# EasyEDA Pro project ProProject_J-Link_WiFi_072_V831_Open_2023-09-08.epro, board J-Link_WiFi_072_V831
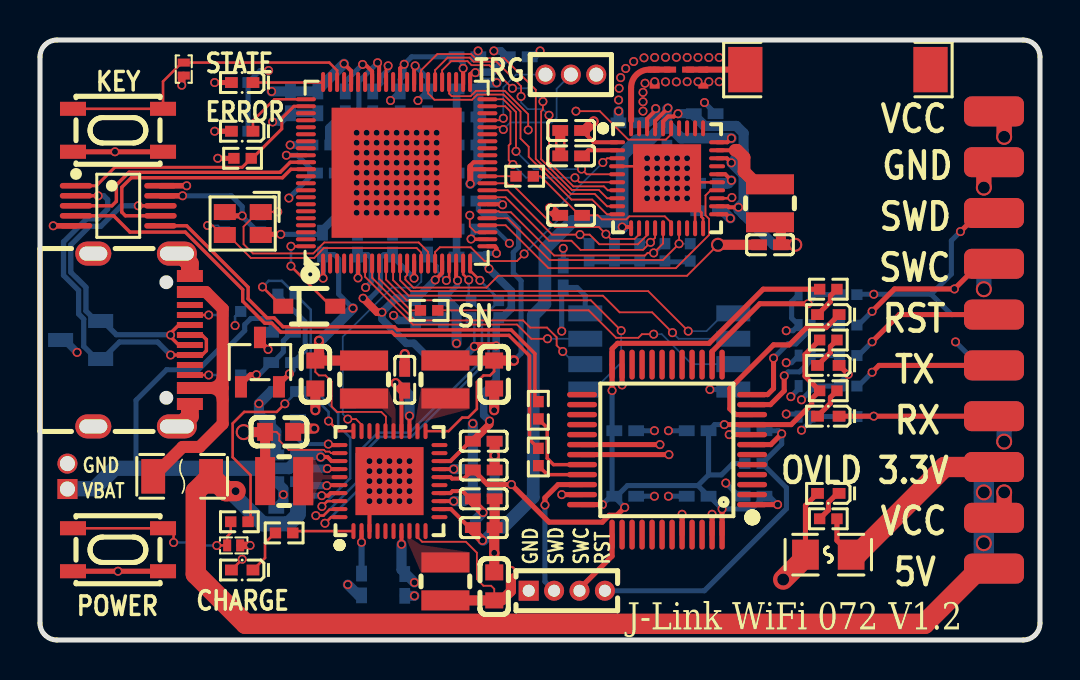
[diagram p4: board, top side]
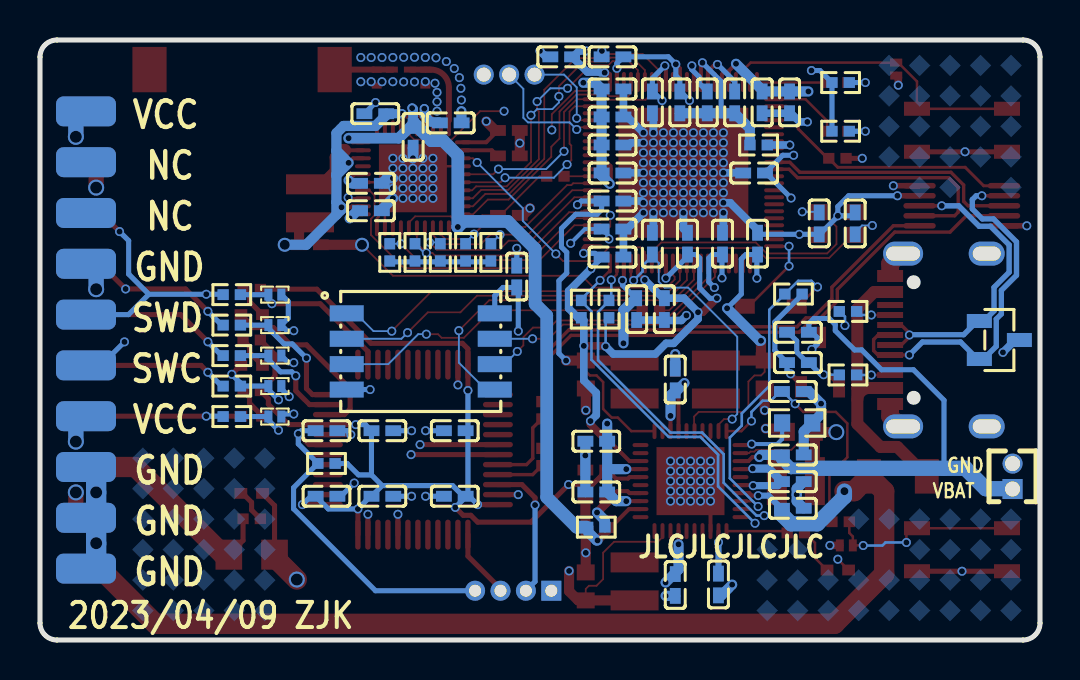
[diagram p5: board, bottom side, seen from below]

Outline 50 x 30 mm; copper layers: Top Layer, Inner1, Inner2, Bottom Layer. Coordinates in mm from the lower left corner of the outline.
Outline path: 0,29.15 0,0.85 arc(0.25,0.25) 0.85,0 49.15,0 arc(49.75,0.25) 50,0.85 50,29.15 arc(49.75,29.75) 49.15,30 0.85,30 arc(0.25,29.75) 0,29.15
Stack: Top Layer 0.035mm / Dielectric1 0.48mm PP er 4.5 / Inner1 0.035mm / Dielectric2 0.48mm FR4 er 4.5 / Inner2 0.035mm / Dielectric3 0.48mm PP er 4.5 / Bottom Layer 0.035mm

## Design rules (mm)
net V831_USB_DP: USB_V831
net V831_USB_DM: USB_V831
net $4N2188: USB_JLINK1
net $4N2309: USB_JLINK1
net USB_DM: USB
net USB_DP: USB
net JLINK_USB_DM: USB_JLINK
net JLINK_USB_DP: USB_JLINK
spacing safeClearance (default): track to track 0.089, other pairs 0.089 to 0.3
track width trackWidth (default): min 0.089, default 0.254, max 12.7
differential pair differentialPair (default): width min 0.127, default 0.254, max 2.54; gap min 0.152, default 0.152
differential pair usb_l1: width min 0.17, default 0.17, max 0.173; gap min 0.102, default 0.102
differential pair usb_l4: width min 0.17, default 0.264, max 0.267; gap min 0.102, default 0.102
via viaSize (default): diameter min 0.3, default 0.3, max 10; hole min 0.2, default 0.2, max 6
net GND uses copperRegion1
net V831_USB_DP uses usb_l1
net V831_USB_DM uses usb_l1
net $4N2188 uses usb_l1
net $4N2309 uses usb_l1
net USB_DM uses usb_l4
net USB_DP uses usb_l4
net JLINK_USB_DM uses usb_l1
net JLINK_USB_DP uses usb_l1
diff pair USB_V831 uses usb_l1
diff pair USB_JLINK1 uses usb_l1
diff pair USB uses usb_l4
diff pair USB_JLINK uses usb_l1

## Placement (name value [footprint] x y rotation side)
C1  2.2uF  [C0402]  12.1 15.38 180 bottom
C2  2.2uF  [C0402]  12.1 13.87 180 bottom
C3  10uF  [C0402]  12.36 6.59 0 bottom
C4  10uF  [C0402]  12.36 7.92 0 bottom
C5  2.2uF  [C0402]  12.36 9.25 180 bottom
C6  2.2uF  [C0402]  16.08 2.78 270 bottom
C7  2.2uF  [C0402]  22.19 9.94 0 bottom
C8  2.2uF  [C0402]  22.19 9.94 0 top
C9  2.2uF  [C0402]  22.19 8.5 0 top
C10  2.2uF  [C0402]  22.19 7.4 0 bottom
C11  2.2uF  [C0402]  22.19 5.62 0 top
C12  2.2uF  [C0402]  22.19 7.06 0 top
C13  100nF  [C0402]  12.36 12.43 0 bottom
C14  4.7uF  [C0402]  18.24 13.02 270 bottom
C15  4.7uF  [C0402]  18.24 13.01 270 top
C16  4.7uF  [C0402]  18.24 2.75 90 bottom
C17  22uF  [C0603]  22.71 13.27 270 top
C18  22uF  [C0603]  13.77 13.27 270 top
C19  22uF  [C0603]  22.71 2.68 90 top
C20  22uF  [C0603]  11.96 10.41 0 top
C21  20pF  [C0402]  11.04 20.83 270 bottom
C22  10uF  [C0402]  21.37 27.55 180 bottom
C23  2.2uF  [C0402]  21.37 26.15 0 bottom
C24  100nF  [C0402]  21.37 24.75 180 bottom
C25  10nF  [C0402]  21.37 23.35 180 bottom
C26  20pF  [C0402]  9.24 20.83 270 bottom
C27  2.2uF  [C0402]  14.29 23.35 0 bottom
C28  100nF  [C0402]  21.37 19.15 180 bottom
C29  100nF  [C0402]  15.88 19.82 90 bottom
C30  100nF  [C0402]  21.37 21.95 180 bottom
C31  1nF  [C0402]  19.38 19.82 270 bottom
C32  100nF  [C0402]  18.78 16.55 90 bottom
C33  100nF  [C0402]  17.63 19.82 270 bottom
C34  10uF  [C0402]  14.12 19.82 270 bottom
C35  2.2uF  [C0402]  20.17 16.55 270 bottom
C36  2.2uF  [C0402]  21.37 20.55 180 bottom
C37  2.2uF  [C0402]  23.94 29.16 0 bottom
C38  1nF  [C0402]  13.89 26.88 90 bottom
C39  1nF  [C0402]  12.52 26.88 90 bottom
C40  2.2uF  [C0402]  21.37 29.16 0 bottom
C41  2.2uF  [C0402]  19.38 26.88 270 bottom
C42  2.2uF  [C0402]  18.01 26.88 270 bottom
C43  470nF  [C0402]  15.27 26.88 270 bottom
C44  470nF  [C0402]  16.64 26.88 270 bottom
C45  10uF  [C0402]  26.16 18.17 90 bottom
C46  5.6pF  [C0402]  26.56 21.23 180 top
C47  1uF  [C0402]  31.34 25.16 90 bottom
C48  1uF  [C0402]  29.46 25.86 0 bottom
C49  470nF  [C0402]  26.56 24.21 180 top
C50  2.2uF  [C0402]  33.45 21.46 180 bottom
C51  470nF  [C0402]  33.45 22.83 180 bottom
C52  100nF  [C0402]  33.24 26.31 180 bottom
C53  100nF  [C0402]  26.56 25.48 0 top
C54  TBD  [C0402#2]  30.73 28.12 90 top
C55  4.7uF  [C0402]  36.5 19.76 0 top
C56  TBD  [C0402#2]  33.17 28.12 90 top
C57  100nF  [C0402]  35.68 10.46 0 bottom
C58  100nF  [C0402]  35.68 7.19 0 bottom
C59  100nF  [C0402]  32.88 10.46 0 bottom
C60  100nF  [C0402]  29.26 10.46 180 bottom
C61  100nF  [C0402]  32.88 7.19 180 bottom
C62  100nF  [C0402]  29.26 7.19 0 bottom
D1  PESDHC2FD4V5BH  [DFN1006-2L-BI]  9.68 4.73 180 top
D2  1N5819WS  [SOD-323_L1.6-W1.3-LS2.6-RD-1]  13.46 16.69 0 top
D3  PESDHC2FD4V5BH  [DFN1006-2L-BI]  7.19 28.55 90 top
D4  PESDHC2FD4V5BH  [DFN1006-2L-BI]  38.26 14.22 180 bottom
D5  PESDHC2FD4V5BH  [DFN1006-2L-BI]  38.26 15.74 180 bottom
D6  PESDHC2FD4V5BH  [DFN1006-2L-BI]  38.26 17.27 180 bottom
D7  PESDHC2FD4V5BH  [DFN1006-2L-BI]  38.26 12.7 0 bottom
D8  PESDHC2FD4V5BH  [DFN1006-2L-BI]  38.26 11.17 0 bottom
L1  1uH  [IND-SMD_L2.5-W2.0_AHP252010X]  20.27 13.02 90 top
L2  1uH  [IND-SMD_L2.5-W2.0_AHP252010X]  16.21 13.02 90 top
L3  1uH  [IND-SMD_L2.5-W2.0_AHP252010X]  20.27 2.93 270 top
L4  1uH  [IND-SMD_L2.5-W2.0_AHP252010X]  12.21 7.94 180 top
L5  2.2uH  [IND-SMD_L2.5-W2.0_AHP252010X]  36.5 21.83 270 top
L6  TBD  [L0201]  31.95 28.52 0 top
L7  AN9520-245  [ANT-SMD_L9.5-W2.1]  39.9 28.52 0 top
LED1  RED  [LED0402-RD]  10.11 3.5 180 top
LED2  GREEN  [LED0402-RD_GREEN]  10.11 27.87 180 top
LED3  RED  [LED0402-RD]  10.11 25.44 180 top
LED4  RED  [LED0402-RD]  39.41 7.33 180 top
LED5  WHITE  [LED0402-RD_WHITE]  39.41 16.27 180 top
LED6  BLUE  [LED0402-RD_BLUE]  39.41 13.73 180 top
LED7  YELLOW  [LED0402-RD_YELLOW]  39.41 11.19 180 top
P1  BAT  [HDR-TH_2P-P1.27-V-M]  1.37 8.18 90 bottom
P2  DEBUG  [HDR-TH_3P-P1.27-V-M-1]  26.54 28.27 180 top
P3  SWD  [HDR-TH_4P-P1.27-V-M]  26.34 2.46 0 top
P4  PORT  [HDR-SMD_20P-P2.54]  47.7 26.43 0 top
R1  2.2kΩ  [R0402]  21.55 16.55 90 bottom
R2  2.2kΩ  [R0402]  22.94 16.55 90 bottom
R3  4.7kΩ  [R0402]  12.33 17.3 0 bottom
R4  SDNT1608X103F3435FTF  [R0603]  12.14 10.85 0 bottom
R5  680Ω  [R0402]  12.21 5.35 0 top
R6  2.2kΩ  [R0402]  9.97 5.91 0 top
R7  33Ω  [R0402]  24.23 23.19 180 top
R8  33Ω  [R0402]  19.46 16.48 0 top
R9  0Ω  [R0402]  14.07 24.75 180 bottom
R10  4.7kΩ  [R0402]  9.97 27.87 180 bottom
R11  4.7kΩ  [R0402]  9.97 25.44 180 bottom
R12  0Ω  [R0402]  22.19 5.64 0 bottom
R13  33kΩ  [R0402]  31.25 19.38 270 bottom
R14  33kΩ  [R0402]  32.51 19.38 270 bottom
R15  33kΩ  [R0402]  29.98 19.38 270 bottom
R16  33kΩ  [R0402]  27.46 19.38 270 bottom
R17  33kΩ  [R0402]  28.72 19.38 270 bottom
R18  5.1kΩ  [R0402]  9.6 16.43 180 bottom
R19  100kΩ  [R0402]  10.13 24.08 0 top
R20  5.1kΩ  [R0402]  9.6 13.25 180 bottom
R21  100kΩ  [R0402]  35.68 8.83 0 bottom
R22  4.7kΩ  [R0402]  39.41 17.54 0 top
R23  680Ω  [R0402]  39.41 6.06 0 top
R24  100Ω  [R0402]  40.41 14.22 180 bottom
R25  100Ω  [R0402]  40.41 15.74 180 bottom
R26  100Ω  [R0402]  40.41 17.27 180 bottom
R27  27Ω  [R0402]  24.92 9.15 90 top
R28  27Ω  [R0402]  24.92 11.49 90 top
R29  100Ω  [R0402]  40.41 11.17 0 bottom
R30  100Ω  [R0402]  40.41 12.7 0 bottom
R31  4.7kΩ  [R0402]  39.41 15 180 top
R32  4.7kΩ  [R0402]  39.41 12.46 180 top
SW1  KEY  [SW-SMD_4P-L4.2-W3.3-P2.15-LS5.1]  3.9 4.51 0 top
SW2  KEY  [SW-SMD_4P-L4.2-W3.3-P2.15-LS5.1]  3.9 25.49 0 top
U1  ME6206A33XG  [SOT-23-3_L2.9-W1.6-P1.90-LS2.8-BR]  11 13.89 270 top
U2  AXP2101  [QFN-40_L5.0-W5.0-P0.40-TL-EP3.4]  17.47 7.94 90 top
U3  V831  [QFN-88_L9.0-W9.0-P0.35-TL-EP6.5]  17.83 23.36 90 top
U4  CSNP1GCR01-BOW  [LGA-8_L6.0-W8.0-P1.27-TL]  30.96 14.43 180 bottom
U5  XR829  [QFN-40_L5.0-W5.0-P0.40-BL-EP3.4]  31.35 23.09 270 top
U6  SGM7222YMS10/TR  [MSOP-10_L3.0-W3.0-P0.50-LS5.0-BL]  3.91 21.71 270 top
U7  SMD0805B050TF  [F0805]  39.41 4.27 0 top
U8  SM05.TCT  [SOT-23-3_L2.9-W1.3-P1.90-LS2.4]  2.03 15 0 bottom
U9  MF-NSMF200-2  [F1206]  7.11 8.18 0 top
U10  STM32F072CBT6  [LQFP-48_L7.0-W7.0-P0.50-LS9.0-BL]  31.35 9.52 90 top
USB1  KH-TYPE-C-16P  [USB-C-SMD_KH-TYPE-C-16P]  5.08 15 270 top
X1  24MHz  [CRYSTAL-SMD_4P-L2.0-W1.6-BL]  10.14 20.82 180 top

## Footprints (pads in the part's own frame, mm; a bottom-side part is the same pattern mirrored in y, then rotated)
ANT-SMD_L9.5-W2.1
  rect 1.71x2.268 smd: 1(-4.63,0) 2(4.63,0)
C0402
  rect 0.79x0.54 smd: 1(-0.545,0) 2(0.545,0)
C0402#2
  rect 0.3x0.5 smd: 1(-0.4,0) 2(0.4,0)
C0603
  rect 0.8x0.9 smd: 1(-0.7,0) 2(0.7,0)
CRYSTAL-SMD_4P-L2.0-W1.6-BL
  rect 1.1x0.8 smd: 1(-0.899,-0.574) 2(0.899,-0.574) 3(0.899,0.574) 4(-0.899,0.574)
DFN1006-2L-BI
  rect 0.4x0.6 smd: 1(-0.325,0) 2(0.325,0)
F0805
  rect 1.335x1.5 smd: 1(-1.143,0) 2(1.143,0)
F1206
  rect 1.192x1.727 smd: 1(-1.446,0) 2(1.446,0)
HDR-SMD_20P-P2.54
  rrect 3x1.5 smd: 1(0,0) 3(0,-2.54) 5(0,-5.08) 7(0,-7.62) 9(0,-10.16) 11(0,-12.7) 13(0,-15.24) 15(0,-17.78) 17(0,-20.32) 19(0,-22.86)
  rrect 3x1.5 smd far side: 2(0,0) 4(0,-2.54) 6(0,-5.08) 8(0,-7.62) 10(0,-10.16) 12(0,-12.7) 14(0,-15.24) 16(0,-17.78) 18(0,-20.32) 20(0,-22.86)
HDR-TH_2P-P1.27-V-M
  rect 1.001x1.001 hole 0.75: 1(-0.635,0)
  round 1.001 hole 0.75: 2(0.635,0)
HDR-TH_3P-P1.27-V-M-1
  round 1.001 hole 0.701: 1(-1.27,0) 2(0,0) 3(1.27,0)
HDR-TH_4P-P1.27-V-M
  rect 1x1 hole 0.6: 1(-1.905,0)
  round 1 hole 0.6: 2(-0.635,0) 3(0.635,0) 4(1.905,0)
IND-SMD_L2.5-W2.0_AHP252010X
  rect 1.001x2.401 smd: 1(-0.95,0) 2(0.95,0)
L0201
  rect 0.6x0.3 smd: 1(-0.45,0) 2(0.451,0)
LED0402-RD
  rect 0.637x0.541 smd: 1(-0.538,0) 2(0.538,0)
LED0402-RD_BLUE
  rect 0.637x0.541 smd: 1(-0.538,0) 2(0.538,0)
LED0402-RD_GREEN
  rect 0.637x0.541 smd: 1(-0.538,0) 2(0.538,0)
LED0402-RD_WHITE
  rect 0.637x0.541 smd: 1(-0.538,0) 2(0.538,0)
LED0402-RD_YELLOW
  rect 0.637x0.541 smd: 1(-0.538,0) 2(0.538,0)
LGA-8_L6.0-W8.0-P1.27-TL
  rect 1.7x0.8 smd: 1(-3.701,1.905) 2(-3.701,0.635) 3(-3.701,-0.635) 4(-3.701,-1.905) 5(3.701,-1.905) 6(3.701,-0.635) 7(3.701,0.635) 8(3.701,1.905)
LQFP-48_L7.0-W7.0-P0.50-LS9.0-BL
  oval 0.27x1.5 smd: 1(-2.75,-4.25) 2(-2.25,-4.25) 3(-1.75,-4.25) 4(-1.25,-4.25) 5(-0.75,-4.25) 6(-0.25,-4.25) 7(0.25,-4.25) 8(0.75,-4.25) 9(1.25,-4.25) 10(1.75,-4.25) 11(2.25,-4.25) 12(2.75,-4.25) 25(2.75,4.25) 26(2.25,4.25) 27(1.75,4.25) 28(1.25,4.25) 29(0.75,4.25) 30(0.25,4.25) 31(-0.25,4.25) 32(-0.75,4.25) 33(-1.25,4.25) 34(-1.75,4.25) 35(-2.25,4.25) 36(-2.75,4.25)
  oval 1.5x0.27 smd: 13(4.25,-2.75) 14(4.25,-2.25) 15(4.25,-1.75) 16(4.25,-1.25) 17(4.25,-0.75) 18(4.25,-0.25) 19(4.25,0.25) 20(4.25,0.75) 21(4.25,1.25) 22(4.25,1.75) 23(4.25,2.25) 24(4.25,2.75) 37(-4.25,2.75) 38(-4.25,2.25) 39(-4.25,1.75) 40(-4.25,1.25) 41(-4.25,0.75) 42(-4.25,0.25) 43(-4.25,-0.25) 44(-4.25,-0.75) 45(-4.25,-1.25) 46(-4.25,-1.75) 47(-4.25,-2.25) 48(-4.25,-2.75)
MSOP-10_L3.0-W3.0-P0.50-LS5.0-BL
  oval 0.28x1.621 smd: 1(-1.001,-2.111) 2(-0.5,-2.111) 3(0,-2.111) 4(0.5,-2.111) 5(1.001,-2.111) 6(1.001,2.111) 7(0.5,2.111) 8(0,2.111) 9(-0.5,2.111) 10(-1.001,2.111)
QFN-40_L5.0-W5.0-P0.40-BL-EP3.4
  oval 0.2x0.8 smd: 1(-1.8,-2.499) 2(-1.4,-2.499) 3(-1,-2.499) 4(-0.6,-2.499) 5(-0.2,-2.499) 6(0.2,-2.499) 7(0.6,-2.499) 8(1,-2.499) 9(1.4,-2.499) 10(1.8,-2.499) 21(1.8,2.499) 22(1.4,2.499) 23(1,2.499) 24(0.6,2.499) 25(0.2,2.499) 26(-0.2,2.499) 27(-0.6,2.499) 28(-1,2.499) 29(-1.4,2.499) 30(-1.8,2.499)
  oval 0.8x0.2 smd: 11(2.499,-1.8) 12(2.499,-1.4) 13(2.499,-1) 14(2.499,-0.6) 15(2.499,-0.2) 16(2.499,0.2) 17(2.499,0.6) 18(2.499,1) 19(2.499,1.4) 20(2.499,1.8) 31(-2.499,1.8) 32(-2.499,1.4) 33(-2.499,1) 34(-2.499,0.6) 35(-2.499,0.2) 36(-2.499,-0.2) 37(-2.499,-0.6) 38(-2.499,-1) 39(-2.499,-1.4) 40(-2.499,-1.8)
  rect 3.4x3.4 smd: 41(0,0)
QFN-40_L5.0-W5.0-P0.40-TL-EP3.4
  oval 0.8x0.201 smd: 1(-2.499,1.801) 2(-2.499,1.399) 3(-2.499,1.001) 4(-2.499,0.6) 5(-2.499,0.201) 6(-2.499,-0.201) 7(-2.499,-0.6) 8(-2.499,-1.001) 9(-2.499,-1.399) 10(-2.499,-1.801) 21(2.499,-1.801) 22(2.499,-1.399) 23(2.499,-1.001) 24(2.499,-0.6) 25(2.499,-0.201) 26(2.499,0.201) 27(2.499,0.6) 28(2.499,1.001) 29(2.499,1.399) 30(2.499,1.801)
  oval 0.201x0.8 smd: 11(-1.801,-2.499) 12(-1.399,-2.499) 13(-1.001,-2.499) 14(-0.6,-2.499) 15(-0.201,-2.499) 16(0.201,-2.499) 17(0.6,-2.499) 18(1.001,-2.499) 19(1.399,-2.499) 20(1.801,-2.499) 31(1.801,2.499) 32(1.399,2.499) 33(1.001,2.499) 34(0.6,2.499) 35(0.201,2.499) 36(-0.201,2.499) 37(-0.6,2.499) 38(-1.001,2.499) 39(-1.399,2.499) 40(-1.801,2.499)
  rect 3.401x3.401 smd: 41(0,0)
QFN-88_L9.0-W9.0-P0.35-TL-EP6.5
  oval 1x0.2 smd: 1(-4.537,3.675) 2(-4.537,3.325) 3(-4.537,2.975) 4(-4.537,2.625) 5(-4.537,2.275) 6(-4.537,1.925) 7(-4.537,1.575) 8(-4.537,1.225) 9(-4.537,0.875) 10(-4.537,0.525) 11(-4.537,0.175) 12(-4.537,-0.175) 13(-4.537,-0.525) 14(-4.537,-0.875) 15(-4.537,-1.225) 16(-4.537,-1.575) 17(-4.537,-1.925) 18(-4.537,-2.275) 19(-4.537,-2.625) 20(-4.537,-2.975) 21(-4.537,-3.325) 22(-4.537,-3.675) 45(4.537,-3.675) 46(4.537,-3.325) 47(4.537,-2.975) 48(4.537,-2.625) 49(4.537,-2.275) 50(4.537,-1.925) 51(4.537,-1.575) 52(4.537,-1.225) 53(4.537,-0.875) 54(4.537,-0.525) 55(4.537,-0.175) 56(4.537,0.175) 57(4.537,0.525) 58(4.537,0.875) 59(4.537,1.225) 60(4.537,1.575) 61(4.537,1.925) 62(4.537,2.275) 63(4.537,2.625) 64(4.537,2.975) 65(4.537,3.325) 66(4.537,3.675)
  oval 0.2x1 smd: 23(-3.675,-4.537) 24(-3.325,-4.537) 25(-2.975,-4.537) 26(-2.625,-4.537) 27(-2.275,-4.537) 28(-1.925,-4.537) 29(-1.575,-4.537) 30(-1.225,-4.537) 31(-0.875,-4.537) 32(-0.525,-4.537) 33(-0.175,-4.537) 34(0.175,-4.537) 35(0.525,-4.537) 36(0.875,-4.537) 37(1.225,-4.537) 38(1.575,-4.537) 39(1.925,-4.537) 40(2.275,-4.537) 41(2.625,-4.537) 42(2.975,-4.537) 43(3.325,-4.537) 44(3.675,-4.537) 67(3.675,4.537) 68(3.325,4.537) 69(2.975,4.537) 70(2.625,4.537) 71(2.275,4.537) 72(1.925,4.537) 73(1.575,4.537) 74(1.225,4.537) 75(0.875,4.537) 76(0.525,4.537) 77(0.175,4.537) 78(-0.175,4.537) 79(-0.525,4.537) 80(-0.875,4.537) 81(-1.225,4.537) 82(-1.575,4.537) 83(-1.925,4.537) 84(-2.275,4.537) 85(-2.625,4.537) 86(-2.975,4.537) 87(-3.325,4.537) 88(-3.675,4.537)
  rect 6.5x6.5 smd: 89(0,0)
R0402
  rect 0.566x0.54 smd: 1(-0.433,0) 2(0.433,0)
R0603
  rect 0.806x0.864 smd: 1(-0.753,0) 2(0.753,0)
SOD-323_L1.6-W1.3-LS2.6-RD-1
  rect 1.001x0.75 smd: 1(-1.3,0) 2(1.3,0)
SOT-23-3_L2.9-W1.3-P1.90-LS2.4
  rect 1.25x0.701 smd: 1(1.001,-0.95) 2(1.001,0.95) 3(-1.001,0)
SOT-23-3_L2.9-W1.6-P1.90-LS2.8-BR
  rect 1.07x0.6 smd: 1(1.235,-0.95) 2(1.235,0.95) 3(-1.235,0)
SW-SMD_4P-L4.2-W3.3-P2.15-LS5.1
  rect 1.3x0.701 smd: 1(-2.251,1.075) 2(2.251,1.075) 3(-2.251,-1.075) 4(2.251,-1.075)
USB-C-SMD_KH-TYPE-C-16P
  oval 1.2x2 hole 0.7x1.7: 1(-4.32,1.765) 2(4.32,1.765)
  oval 1.2x1.8 hole 0.7x1.4: 3(-4.32,-2.415) 4(4.32,-2.415)
  rect 0.3x1.3 smd: A1(-3.35,2.415) A4(-2.55,2.415) A5(-1.25,2.415) A6(-0.25,2.415) A7(0.25,2.415) A8(1.25,2.415) A9(2.55,2.415) A12(3.35,2.415) B1(3.05,2.415) B4(2.25,2.415) B5(1.75,2.415) B6(0.75,2.415) B7(-0.75,2.415) B8(-1.75,2.415) B9(-2.25,2.415) B12(-3.05,2.415)

## Nets
As in the schematic.

Pads without a net: L7 2; P4 4 6; U2 4 5 6 10 11 15 19 20 27 28; U3 2 3 4 5 36 37 38 39 42 47 54 56 60 61 63 65 69 70 71 72 73 74 78 79 80 81 82 83 84 85 86 87; U5 18 27 31 32 33 34 39; U10 2 3 4 5 6 13 15 16 17 18 19 20 21 22 25 26 27 28 29 38 39 40 41 42 43 45 46; USB1 A8 B8

## Via types
v1: diameter 0.45, hole 0.3, Top Layer to Bottom Layer, 346 vias
v2: diameter 0.8, hole 0.6, Top Layer to Bottom Layer, 9 vias
v3: diameter 0.7, hole 0.5, Top Layer to Bottom Layer, 2 vias
v4: diameter 0.6, hole 0.4, Top Layer to Bottom Layer, 1 via

## Routing (per net, layer and track width the routed paths; a pad name or vN(x,y) marks a point on that pad's centre or on a via; arc(x,y) is an arc through that point)
AGND: length 8.6
  Top Layer w0.201: v1(16.88,28.86) 16.96,28.79 U3.58
  Bottom Layer w0.254: v1(16.88,28.86) 15.94,27.93 15.94,26.34
  Bottom Layer w0.508: C42.2 C44.2 C43.2 14.5,25.57 14.5,24.75
AVCC: length 60.6
  Top Layer w0.201: 20.11,18.95 20.11,18.35 v1(19.76,18) ; U2.18 20.53,8.94 21.52,9.94 21.64,9.94 ; v1(21.16,28.58) 21.16,27.77 ; 18.01,27.77 18.01,28.58 v1(18.21,28.79) ; v1(22.82,19.33) 22.82,19.59 22.72,19.69 U3.23 ; v1(18.71,18.09) 18.71,18.95 ; U3.75 v1(12.32,24.24)
  Top Layer w0.381: v1(22.81,14.71) 21.74,14.71 v1(21.72,14.68) ; v1(16.15,17.09) 16.85,16.39 v1(17.1,16.39) ; v1(22.48,10.95) 22.48,10.78 21.64,9.94
  Inner2 w0.254: v1(12.32,24.24) 12.06,24.49 12.06,25.25 13.23,26.42 16.97,26.42 v1(17.53,26.97) ; v1(12.45,22.1) 12.45,21.66 15.4,18.7 15.4,17.84 v1(16.15,17.09)
  Bottom Layer w0.127: v1(21.72,14.68) 21.72,15.95 R1.1
  Bottom Layer w0.254: 21.92,19.15 22.05,19.15 ; 22.05,19.15 22.05,18.97 v1(22.45,18.56) ; 22.05,19.15 22.07,19.15 22.26,19.33 v1(22.82,19.33) ; v1(12.32,24.24) 12.86,24.24 C27.1 13.7,23.35 12.45,22.1 ; v1(18.71,18.09) 17.63,19.17 C33.2 17.19,19.27 17.02,19.1 17.02,17.6 16.5,17.08 16.16,17.08 v1(16.15,17.09) ; v1(17.53,26.97) 17.98,27.43 C42.1 18.01,28.02 18.21,28.22 v1(18.21,28.79) 18.58,29.16 C40.1 21.16,28.83 v1(21.16,28.58)
  Bottom Layer w0.381: v1(21.72,14.68) 21.34,14.3 19.23,14.3 18.69,14.83 18.31,14.83 17.1,16.05 v1(17.1,16.39) ; v1(19.76,18) 18.85,17.09 C32.2 17.8,17.09 17.1,16.39 ; v1(22.48,10.95) 22.48,10.95 22.19,11.24 22.19,12.36 22.81,12.98 v1(22.81,14.71) 22.81,15.99 R2.1 23.1,16.11 23.57,16.58 23.57,17.45 v1(22.45,18.56)
GND: length 142.6
  Top Layer w0.089: v3(33.9,19.76) 32.35,18.21 22.91,18.21 22.32,17.62 18.67,17.62 18.27,18.02 18.27,18.16 18.36,18.25 18.36,18.95
  Top Layer w0.127: v1(32.35,22.09) 33.07,21.37 33.07,21.16 33.15,21.08 U5.20 ; U5.4 30.05,23.69 ; 33.85,22.89 32.65,22.89 ; 32.75,21.69 U5.19
  Top Layer w0.201: U2.3 16.47,6.28
  Top Layer w0.254: v1(29.1,12.75) U10.23 ; v1(10.82,13.26) 10.53,13.26 10.05,12.79 U1.1 ; v1(8.89,24.08) R19.1 ; X1.2 9.43,21.21 v1(10.11,21.21) ; v1(33.6,6.28) U10.47 ; X1.4 11.07,20.28 v1(12.04,20.28) ; SW2.4 v1(3.75,24.41) SW2.3 ; SW1.4 v1(3.9,3.44) SW1.3 ; v1(34.46,10.27) U10.8 ; v1(32.1,6.28) U10.44 ; v1(26.09,7.27) U10.35
  Top Layer w0.28: 1.8,20.71 v1(0.66,20.71) ; U6.9 v1(7.13,22.21)
  Top Layer w0.381: D3.1 7.09,28.12 v1(7.09,27.74) ; v1(10.5,4.73) D1.1
  Top Layer w0.508: C19.2 22.71,4.36 v1(22.71,4.36) 22.71,5.6 C11.2 C12.2 ; 18.24,13.56 v1(18.24,14.29) ; v1(25.5,21.59) 25.86,21.23 C46.2 ; v3(33.9,19.76) 35.95,19.76 ; C53.1 v1(26.01,24.84) C49.2 ; v1(22.71,11.49) C17.2 ; v1(13.72,10.57) 12.82,10.57 C20.2 ; v1(13.77,11.49) C18.2 ; 22.73,8.51 22.73,8.51 v1(22.73,9.23) 22.73,9.94 C8.2
  Top Layer w0.762: 47.19,23.89 v2(47.19,22.62)
  Top Layer w0.889: USB1.2 6.99,10.68 7.5,11.18 USB1.A12 ; USB1.A1 7.5,18.82 6.99,19.32 USB1.1
  Inner1 w0.762: v2(47.19,22.62) v2(47.19,17.54)
  Inner2 w0.762: v2(47.19,17.54) v2(47.19,22.62)
  Bottom Layer w0.127: v1(9.75,15.72) 9.75,16.17 10.03,16.45 ; v1(10.82,13.26) 10.05,13.26
  Bottom Layer w0.254: v1(37.31,15.46) 37.65,15.46 D5.2 37.58,16.09 37.58,16.92 D6.2 ; C34.1 14.04,20.28 v1(12.04,20.28) 11.06,20.28 11.04,20.26 10.14,21.16 ; D7.1 37.93,12.56 v1(37.54,12.17) ; 33.22,26.87 C52.1 ; C45.2 v1(26.16,19.58) ; v1(31.42,10.46) C59.1 ; C26.1 9.4,21.21 v1(10.11,21.21) ; v1(10.11,21.21) 10.11,21.21 ; v1(10.11,21.21) 10.11,21.67 9.57,22.21 v1(7.13,22.21) ; v1(10.82,13.26) 10.95,13.26 11.56,13.87 11.64,13.87 12.17,14.4 12.17,14.96 12.59,15.38 C1.1 ; v1(31.42,7.19) C61.2 ; v1(37.31,13.86) 37.58,13.86 D4.2 ; v1(33.5,12.52) U4.4 ; v1(30.72,10.46) C60.1 ; v1(34.46,10.27) 34.66,10.46 C57.1 ; v1(30.72,7.19) C62.2 ; D8.1 37.81,11.3 v1(37.31,11.3) ; C58.1 34.95,7.19 v1(34.29,7.85)
  Bottom Layer w0.381: 19.83,24.86 20.45,24.86 20.56,24.75 C24.2 ; v1(19.83,25.36) 20.62,26.15 C23.1 C22.2 ; C33.1 17.83,20.57 v1(17.83,21.36) ; C27.2 14.85,23.36 v1(15.83,23.36) ; C29.2 15.83,20.41 v1(15.83,21.36) ; v1(19.33,25.36) 19.33,26.29 C41.2 ; C37.2 24.71,29.16 v1(25.01,29.45) ; v1(19.83,21.86) 19.92,21.95 C30.2 ; v1(15.83,21.86) 15.49,21.86 14.12,20.5 C34.1 ; 21.92,29.16 21.92,29.44 v1(21.91,29.45) ; v1(17.68,16.23) 17.93,15.98 18.76,15.98 C32.1 18.78,16 20.16,16 C35.2 ; v1(19.83,23.36) 20.82,23.36 C25.2 ; v1(1.85,14.38) 1.24,15 1.03,15 ; C28.2 C36.2 20.65,20.55 v1(19.83,21.36) ; C31.1 19.33,20.41 v1(19.33,21.36) ; C38.1 12.44,26.34 12.01,25.9 v1(11.63,25.9) ; v1(12.51,24.75) R9.2
  Bottom Layer w0.508: v1(28.93,26.44) 28.93,25.87 C48.1 ; v1(31.35,24.09) 31.35,24.6 C47.1 ; 32.91,21.46 32.91,21.53 v1(32.35,22.09) ; 11.81,12.43 11.56,12.43 v1(10.95,11.82) 10.95,11.29 R4.1 11.81,10.43 11.81,9.25 ; v1(32.35,23.09) 32.66,23.09 32.91,22.83 ; v1(18.24,14.29) 18.24,13.56 ; v1(15.39,2.77) 15.93,2.23 C6.2 ; 11.81,6.59 12.17,6.94 v1(12.17,7.27) 12.17,7.57 11.81,7.92 ; C16.1 v1(18.72,2.21) ; C10.2 22.73,7.4 v1(22.73,9.23) 22.73,9.94 C8.2
  Bottom Layer w0.762: 47.19,18.81 v2(47.19,17.54)
  Bottom Layer w1.016: 47.19,3.57 v2(47.19,4.84) v2(47.19,7.38) 47.19,8.65
  vias: v1(15.83,25.36) v1(15.83,24.86) v1(15.83,24.36) v1(15.83,23.86) v1(15.83,22.86) v1(15.83,22.36) v1(16.33,25.36) v1(16.33,24.86) v1(16.33,24.36) v1(16.33,23.86) v1(16.33,23.36) v1(16.33,22.86) v1(16.33,22.36) v1(16.33,21.86) v1(16.33,21.36) v1(16.47,8.94) v1(16.47,8.44) v1(16.47,7.94) v1(16.47,7.44) v1(16.47,6.94) v1(16.83,25.36) v1(16.83,24.86) v1(16.83,24.36) v1(16.83,23.86) v1(16.83,23.36) v1(16.83,22.86) v1(16.83,22.36) v1(16.83,21.86) v1(16.83,21.36) v1(16.97,8.94) v1(16.97,8.44) v1(16.97,7.94) v1(16.97,7.44) v1(16.97,6.94) v1(17.33,25.36) v1(17.33,24.86) v1(17.33,24.36) v1(17.33,23.86) v1(17.33,23.36) v1(17.33,22.86) v1(17.33,22.36) v1(17.33,21.86) v1(17.33,21.36) v1(17.47,8.94) v1(17.47,8.44) v1(17.47,7.94) v1(17.47,7.44) v1(17.47,6.94) v1(17.83,25.36) v1(17.83,24.86) v1(17.83,24.36) v1(17.83,23.86) v1(17.83,23.36) v1(17.83,22.86) v1(17.83,22.36) v1(17.83,21.86) v1(17.97,8.94) v1(17.97,8.44) v1(17.97,7.94) v1(17.97,7.44) v1(17.97,6.94) v1(18.33,25.36) v1(18.33,24.86) v1(18.33,24.36) v1(18.33,23.86) v1(18.33,23.36) v1(18.33,22.86) v1(18.33,22.36) v1(18.33,21.86) v1(18.33,21.36) v1(18.47,8.94) v1(18.47,8.44) v1(18.47,7.94) v1(18.47,7.44) v1(18.47,6.94) v1(18.83,25.36) v1(18.83,24.86) v1(18.83,24.36) v1(18.83,23.86) v1(18.83,23.36) v1(18.83,22.86) v1(18.83,22.36) v1(18.83,21.86) v1(18.83,21.36) v1(19.33,24.86) v1(19.33,24.36) v1(19.33,23.86) v1(19.33,23.36) v1(19.33,22.86) v1(19.33,22.36) v1(19.33,21.86) v1(19.83,24.86) v1(19.83,24.36) v1(19.83,23.86) v1(19.83,22.86) v1(19.83,22.36) v1(28.93,27) v1(29.03,28.12) v1(28.96,27.58) v1(29.29,28.58) v1(29.68,28.92) v1(30.2,29.11) v1(30.15,27.38) v1(30.15,26.91) v1(30.15,26.44) v1(30.25,27.84) v1(30.35,24.09) v1(30.35,23.59) v1(30.35,23.09) v1(30.35,22.59) v1(30.35,22.09) v1(30.73,29.13) v1(30.73,27.91) v1(30.85,24.09) v1(30.85,23.59) v1(30.85,23.09) v1(30.85,22.59) v1(30.85,22.09) v1(31.28,29.13) v1(31.28,27.91) v1(31.35,23.59) v1(31.35,23.09) v1(31.35,22.59) v1(31.35,22.09) v1(31.82,29.13) v1(31.82,27.91) v1(31.85,24.09) v1(31.85,23.59) v1(31.85,23.09) v1(31.85,22.59) v1(31.85,22.09) v1(32.36,29.13) v1(32.36,27.91) v1(32.35,24.09) v1(32.35,23.59) v1(32.35,22.59) v1(32.9,29.13) v1(32.9,27.91) v1(33.22,26.87) v1(33.44,29.13) v1(33.44,27.91) v1(33.96,29.13) v1(33.96,27.91)
V831_USB_DM: length 13.2
  Top Layer w0.17: 13.71,23.54 12.54,23.54 12.12,23.11 4.57,23.11 4.09,22.64 4.09,21.39 4.27,21.21 U6.7
V831_USB_DP: length 13.3
  Top Layer w0.17: 13.71,23.89 12.51,23.89 12.01,23.39 4.45,23.39 3.82,22.75 3.82,21.93 3.59,21.71 U6.3
VBAT: length 29.1
  Top Layer w0.201: U2.33 14.58,8.95 14.37,9.15 14.04,9.15
  Top Layer w0.254: 11,15.13 11,14.94 v1(11.4,14.53)
  Bottom Layer w0.254: v1(11.4,14.53) 11.14,14.8 11.14,15.12 11.41,15.38 11.56,15.38 11.56,15.82 11.3,16.08 10.54,16.08 10.24,15.77 10.24,15.47 9.27,14.5 8.91,14.5 7.92,13.51 6.32,13.51 4.8,11.99 4.8,8.58
  Bottom Layer w0.508: v1(14.04,9.15) 13.93,9.25 C5.1
  Bottom Layer w0.584: 12.45,8.58 12.9,9.04 12.9,9.23 ; 12.45,8.58 11.12,8.58 ; 12.45,8.58 12.44,8.58 ; 1.37,7.57 P1.1
  Bottom Layer w0.762: 1.37,7.57 2.71,7.57 3.73,8.58 11.12,8.58
VBUS: length 15.7
  Top Layer w0.6: 9.13,12.01 arc(8.96,12.43) 8.54,12.6 arc(8.96,12.77) 9.13,13.2 ; 9.13,12.6 9.13,16.56 8.3,17.4 7.99,17.4 ; 9.13,12.6 7.15,12.6 ; 9.13,12.6 9.13,10.81 7.98,9.65 7.13,9.65 U9.1
VCC: length 55.6
  Top Layer w0.201: U2.37 14.54,7.34 14.41,7.22 v1(14.09,7.22)
  Top Layer w1.016: P4.19 46.99,3.57 44.23,0.81 10.28,0.81 7.79,3.3 7.79,7.43 8.54,8.18 U9.2 9.29,7.44 v4(9.78,7.44)
  Bottom Layer w0.305: C3.2 12.94,6.59 13.57,7.22 v1(14.09,7.22)
  Bottom Layer w0.762: 12.9,6.46 12.9,6.27 12.44,5.81 11.13,5.81 9.78,7.16 v4(9.78,7.44)
VCC_CARD: length 63.8
  Top Layer w0.127: 22.71,13.97 22.71,13.43 22.5,13.23 22.17,13.23 21.84,12.9 21.84,11.55 21.41,11.12 21.11,11.12 20.43,10.44 U2.21
  Top Layer w0.201: v1(15.9,18.1) 15.91,18.11 U3.6 ; U3.29 23.1,21.79 v1(23.13,21.76) ; 18.71,27.77 18.71,28.66 v1(18.76,28.71)
  Top Layer w0.508: L1.2 23.69,13.97 v1(23.7,13.97)
  Inner1 w0.254: v1(26.09,15.44) 26.09,15.09 24.97,13.97 v1(23.7,13.97)
  Inner2 w0.254: 22.58,22.28 21.65,22.28 19.41,20.04 18.7,20.04 v1(16.28,17.62) ; 22.58,22.28 22.58,24.1 20.6,26.09 19.79,26.09 v1(18.9,26.97) 18.29,26.97 17.68,27.58 13.31,27.58 12.42,28.47 v1(11.43,28.47) ; 22.58,22.28 22.61,22.28 v1(23.13,21.76)
  Bottom Layer w0.254: U4.8 27.26,17.21 26.85,17.63 C45.1 26.16,17.47 26.09,17.4 v1(26.09,15.44) ; v1(18.9,26.97) 19.35,27.43 C41.1 19.38,28.09 v1(18.76,28.71) ; v1(23.7,13.97) 24.05,14.33 24.05,17.96 23.66,18.35 23.66,19.39 23.93,19.65 23.93,20.57 23.22,21.28 22.15,21.28 21.92,21.51 21.92,21.95 22.94,21.95 v1(23.13,21.76) ; v1(11.43,28.47) 11,28.47 R10.1 R11.1 ; v1(15.9,18.1) 15.9,19.25 C29.1 16.38,19.27 16.56,19.1 16.56,17.9 v1(16.28,17.62)
VCC_DRAM: length 45.9
  Top Layer w0.089: C19.1 22.71,2.55 22.56,2.71 22.17,2.71 21.84,3.04 21.84,4.36 21.3,4.91 19.11,4.91 18.87,5.14 U2.9
  Top Layer w0.201: 21.51,23.54 22.24,23.54 ; 22.24,23.89 21.68,23.89 21.51,23.72
  Top Layer w0.305: 21.51,23.67 v1(21.51,22.81)
  Top Layer w0.508: L3.2 C19.1 23.09,1.98 23.55,2.44 v1(23.55,3.45)
  Inner2 w0.508: 24.66,24.44 23.84,25.27 23.84,26.51 23.04,27.32 23.04,27.66 v1(22.83,27.86)
  Inner2 w1.016: 24.66,24.33 24.66,20.04 25.18,19.52 25.18,16.7 24.31,15.82 24.31,14.81 25.04,14.07 25.04,12.73 24.41,12.09 24.41,4.33 23.55,3.46 v1(23.55,3.45)
  Bottom Layer w0.508: v1(21.51,22.81) 21.92,23.21 21.92,27.55 22.23,27.86 v1(22.83,27.86)
VCC_JLINK3.3: length 11
  Top Layer w0.254: U7.2 39.85,4.98 R23.2
  Top Layer w1.016: P4.15 45.23,8.65 40.84,4.27 U7.2
VCC_JLINKOUT: length 40.6
  Top Layer w0.762: v2(48.21,25.16) 48.21,26.43 ; v2(48.21,7.38) 48.21,6.11
  Inner1 w0.762: v2(48.21,25.16) v2(48.21,9.92) v2(48.21,7.38)
  Inner2 w0.762: v2(48.21,7.38) v2(48.21,9.92) v2(48.21,25.16)
  Bottom Layer w0.762: v2(48.21,25.16) 48.21,26.43 ; v2(48.21,9.92) 48.21,11.19
VCC_WIFI_IO: length 5.1
  Bottom Layer w0.254: 27.46,18.91 32.51,18.91
AP_WAKE_BT: length 9.3
  Top Layer w0.089: 22.24,27.04 23.16,27.04 23.8,26.4 v1(23.8,24.43) ; U5.5 27.34,23.29 v1(27.08,23.55)
  Bottom Layer w0.089: v1(23.8,24.43) 24.69,23.55 v1(27.08,23.55)
BT_RESETN: length 19.3
  Top Layer w0.089: 20.46,27.77 20.46,27.32 20.59,27.19 21.53,27.19 21.8,27.46 23.24,27.46 24.41,26.29 v1(24.41,25.5)
  Top Layer w0.127: v1(34.59,22.12) 34.56,22.09 U5.23
  Inner2 w0.089: v1(24.41,25.5) 24.63,25.28 26.28,25.28 27.1,24.46 32.87,24.46 33.93,23.39 34.72,23.39 34.95,23.16 34.95,22.48 v1(34.59,22.12)
BT_UART_CTS: length 14.3
  Top Layer w0.089: v1(23.62,27.58) 22.47,28.74 21.58,28.74 21.38,28.94 20.56,28.94 20.11,28.49 20.11,27.77 ; U5.8 28.36,22.09 27.94,22.5 26.59,22.5 25.06,24.04 25.06,26.43 25.15,26.52 v1(25.15,26.92)
  Bottom Layer w0.089: v1(23.62,27.58) 24.49,27.58 v1(25.15,26.92)
BT_UART_RTS: length 14.7
  Top Layer w0.089: U5.7 28.39,22.49 28.19,22.68 26.67,22.68 25.45,23.9 v1(25.45,26.24) ; v1(24.05,27.18) 24.05,27.69 22.82,28.92 21.68,28.92 21.48,29.12 20.38,29.12 19.76,28.49 19.76,27.77
  Bottom Layer w0.089: v1(25.45,26.24) 25.15,26.54 24.38,26.54 24.05,26.87 v1(24.05,27.18)
BT_UART_RX: length 16
  Top Layer w0.089: U5.9 28.35,21.69 27.74,22.3 26.54,22.3 24.79,24.06 24.79,27.51 23.2,29.1 21.76,29.1 21.56,29.3 19.87,29.3 19.06,28.49 19.06,27.77
BT_UART_TX: length 13.7
  Top Layer w0.089: U5.10 28.35,21.29 27.61,22.02 26.57,22.02 24.44,24.16 24.44,24.66 24.03,25.07 24.03,26.42 23.18,27.27 21.86,27.27 21.6,27.01 19.72,27.01 19.41,27.33 19.41,27.77
BT_WAKE_AP: length 9.7
  Top Layer w0.089: v1(23.65,23.77) 23.43,23.99 23.43,24.72 23.52,24.81 23.52,26.42 23.26,26.69 22.24,26.69 ; 28.85,22.89 26.97,22.89 v1(26.75,23.11)
  Bottom Layer w0.089: v1(26.75,23.11) 24.31,23.11 v1(23.65,23.77)
JLINK_RST: length 18.1
  Top Layer w0.254: v1(37.08,10.31) 36.54,9.77 U10.7
  Bottom Layer w0.254: C57.2 36.93,10.46 v1(37.08,10.31) 37.08,9.8 R21.2 37.32,7.61 37.32,6.56 33.22,2.46 P3.4
JLINK_RX: length 8.6
  Top Layer w0.254: LED7.1 v1(41.69,11.19) 47.7,11.19
  Bottom Layer w0.254: v1(41.69,11.19) 40.86,11.19 R29.2
JLINK_TX: length 7.3
  Top Layer w0.254: v1(41.6,13.39) 41.95,13.73 P4.11
  Bottom Layer w0.254: R30.2 40.92,12.7 v1(41.6,13.39)
JLINK_USB_DM: length 24.2
  Top Layer w0.17: R28.2 24.75,12.09 24.75,14.32 23.56,15.5 17.87,15.5 17.71,15.66 12.15,15.66 11.7,16.11 11.35,16.11 10.41,17.05 10.41,17.64 7.33,20.71 6.02,20.71
JLINK_USB_DP: length 30.7
  Top Layer w0.17: U6.4 3.68,21.21 4.5,20.4 7.26,20.4 10.13,17.52 10.13,16.94 11.24,15.84 11.59,15.84 12.04,15.39 17.6,15.39 17.76,15.23 23.45,15.23 24.47,14.21 24.47,10.03 R27.2
PMU_IRQ: length 4.9
  Top Layer w0.127: v1(12.55,18.69) 14.55,16.69 D2.2 ; v1(12.55,19.69) 13.42,19.69
  Bottom Layer w0.127: v1(12.55,18.69) v1(12.55,19.69)
PMU_PWROK: length 14.4
  Top Layer w0.089: v1(15.39,11.05) 15.8,11.05 16.08,10.77 U2.29
  Top Layer w0.127: v1(20.32,17.98) 20.46,18.12 U3.19
  Bottom Layer w0.089: 19.38,19.17 19.06,18.86 19.06,17.92 18.77,17.62 17.59,17.62 15.14,15.16 15.14,11.3 v1(15.39,11.05)
  Bottom Layer w0.127: 19.41,19.18 19.87,18.71 19.87,18.43 v1(20.32,17.98)
  Bottom Layer w0.254: C31.2 19.38,19.17
PMU_PWRON: length 9.7
  Top Layer w0.127: v1(6.68,4.88) 6.68,5.59 SW1.2 SW1.1 ; R6.1 9.54,5.35 9.36,5.18 D1.2 8.84,4.73 v1(8.84,4.72)
  Bottom Layer w0.127: v1(6.68,4.88) 7.73,4.88 7.88,4.72 v1(8.84,4.72)
PMU_SCL: length 19
  Top Layer w0.127: v1(14.25,5.84) 14.55,6.14 U2.40 ; v1(22,17.98) 21.51,18.47 U3.22
  Bottom Layer w0.127: v1(22,17.98) 22.94,17.04 22.94,16.94 22.43,16.43 22.43,14.02 18.57,10.16 16.98,10.16 16.1,9.27 16.1,7.68 14.25,5.84
PMU_SDA: length 18.9
  Top Layer w0.127: v1(13.79,6.22) 14.17,6.22 14.47,6.52 14.95,6.52 U2.39 ; v1(21.44,18) 21.16,18.28 U3.21
  Bottom Layer w0.127: R1.2 21.44,17.09 v1(21.44,18) ; v1(13.79,6.22) 14.17,6.22 15.82,7.86 15.82,9.29 16.89,10.37 18.48,10.37 22.1,13.99 22.1,16.4 21.55,16.95 21.55,16.98
RESET: length 7.7
  Top Layer w0.254: v1(41.6,14.91) 42.97,16.27 P4.9
  Bottom Layer w0.254: R24.1 40.92,14.22 v1(41.6,14.91)
RFCLK: length 12.4
  Top Layer w0.089: v1(28.14,23.88) 28.35,24.09 U5.3 ; v1(24.21,19.3) 23.85,18.95 22.22,18.95 21.54,19.63 19.99,19.63 19.76,19.4 19.76,18.95
  Bottom Layer w0.089: v1(28.14,23.88) 25.86,21.59 25.86,20.96 v1(24.21,19.3)
SDC0_CLK: length 16
  Top Layer w0.089: v1(30.68,15.29) 30.1,15.29 29.92,15.11 28.81,15.11 27.43,16.48 19.89,16.48 R8.2
  Bottom Layer w0.089: v1(30.68,15.29) 31.09,15.29 32.59,13.79 U4.3
SDC0_CMD: length 17.7
  Top Layer w0.089: v1(29.06,15.47) 27.54,16.99 18.34,16.99 17.31,18.02 17.31,18.95
  Bottom Layer w0.089: U4.5 27.71,12.52 29.06,13.87 v1(29.06,15.47)
SDC0_D0: length 13.5
  Top Layer w0.089: v1(26.14,14.43) 25.83,14.73 25.83,15.14 25.35,15.62 24.51,15.62 24.16,15.98 18.74,15.98 16.61,18.11 16.61,18.95
  Bottom Layer w0.089: v1(26.14,14.43) 26.77,13.79 U4.6
SDC0_D1: length 13.1
  Top Layer w0.089: 16.26,18.95 16.26,18.16 18.64,15.77 23.85,15.77 24.56,15.06 v1(25.37,15.06)
  Bottom Layer w0.089: v1(25.37,15.06) U4.7
SDC0_D2: length 19.1
  Top Layer w0.089: 18.01,18.95 18.01,17.98 18.54,17.44 30.41,17.44 v1(32.41,15.44)
  Bottom Layer w0.089: U4.1 34.21,16.33 33.32,15.44 v1(32.41,15.44)
SDC0_D3: length 19.2
  Top Layer w0.089: 17.66,18.95 17.66,17.99 18.44,17.21 28.15,17.21 28.98,16.38 30.61,16.38 v1(31.62,15.37)
  Bottom Layer w0.089: v1(31.62,15.37) 31.93,15.06 U4.2
SWC_IN: length 3.5
  Top Layer w0.254: P3.3 26.97,2.57 28.6,4.19 U10.37
SWCLK: length 13.2
  Top Layer w0.254: v1(41.6,16.43) 42.72,17.55 v1(45.72,17.55) 46.98,18.81 P4.7
  Inner2 w0.508: v1(45.72,17.55) 45.78,17.5 v1(45.78,14.91)
  Bottom Layer w0.254: R25.1 40.92,15.74 v1(41.6,16.43) ; v1(45.78,14.91) 46.95,13.73 P4.12
SWD_IN: length 7
  Top Layer w0.254: v1(25.25,6.75) 25.25,7.11 25.9,7.77 U10.34
  Bottom Layer w0.254: P3.2 25.25,2.92 v1(25.25,6.75)
SWDIO: length 13.1
  Top Layer w0.254: P4.5 46.95,21.35 v1(46.02,20.42)
  Bottom Layer w0.254: 44.56,17.29 v1(41.69,17.29) 40.86,17.29 R26.1 ; 44.56,17.29 45.57,18.3 45.57,19.97 v1(46.02,20.42) ; 44.56,17.29 45.57,16.27 P4.10
UART0_RX: length 6.3
  Top Layer w0.089: 22.24,25.64 23.05,25.64 v1(23.16,25.53)
  Bottom Layer w0.089: P2.2 25.83,27.56 25.83,26.11 25.6,25.88 23.52,25.88 v1(23.16,25.53)
UART0_TX: length 4.9
  Top Layer w0.089: 22.24,25.99 23.07,25.99 v1(23.16,26.09)
  Bottom Layer w0.089: v1(23.16,26.09) 23.16,27.63 23.8,28.27 P2.3
USB_DM: length 16.1
  Top Layer w0.17: USB1.A7 6.94,14.75 6.53,15.16 v1(6.53,15.25) 6.53,15.34 6.94,15.75 USB1.B7 ; U6.8 v1(4.91,21.71)
  Bottom Layer w0.264: v1(6.53,15.25) 6.51,15.27 3.81,15.27 3.13,15.95 U8.1
  Bottom Layer w0.267: v1(4.91,21.71) 4.06,21.71 3.04,20.69 2.47,20.69 1.54,19.75 1.54,18.39 2.3,17.63 2.3,16.46 2.8,15.95 U8.1
USB_DP: length 19.2
  Top Layer w0.17: USB1.A6 8.09,15.25 8.32,15.02 8.32,14.47 8.1,14.25 v1(6.53,14.25) ; U6.2 v1(2.91,22.21)
  Bottom Layer w0.264: v1(6.53,14.25) 5.88,14.9 3.97,14.9 3.12,14.05 2.82,14.05 2.19,14.68 2.19,16.05 1.93,16.3 1.93,17.48 1.18,18.23 1.18,19.91 2.32,21.05 2.88,21.05 3.38,21.55 3.38,22.02 3.19,22.21 v1(2.91,22.21)
USB_SWITCH: length 13.6
  Top Layer w0.15: 13.42,26.69 12.69,26.69 12.09,26.08 12.09,25.56 10.62,24.08 10.56,24.08 10.11,23.63 3.74,23.63 2.82,22.71 U6.1
VALDO3: length 87.1
  Top Layer w0.201: 21.64,8.51 21.2,8.07 20.6,8.07 20.53,8.14 U2.16
  Top Layer w0.254: v1(34.21,10.77) U10.9 37.56,10.77 38.58,11.79 38.58,12.06 R32.2 38.25,13.19 38.25,14.27 R31.2 ; R22.1 36.16,17.54 33.45,14.83 28.88,14.83 28.6,14.56 U10.24 v1(28.6,12.47) ; v1(36.88,6.77) U10.1 ; v1(29.24,6.63) 28.84,6.23 28.46,6.23 28.12,5.89 25.45,5.89 v1(23.57,7.77) 22.38,7.77 21.64,8.51 ; U10.48 v1(34.1,6.55) ; v1(28.12,6.77) U10.36
  Top Layer w0.28: v1(7.33,22.71) U6.10
  Inner2 w0.254: v1(7.33,22.71) 7.92,22.71 9.96,20.68 9.96,18.2 12.66,15.49 15.26,15.49 15.97,14.78 18.41,14.78 19.11,14.08 22.03,14.08 23.57,12.55 v1(23.57,7.77)
  Bottom Layer w0.254: 33.43,8.25 34.07,8.25 34.64,8.83 R21.1 ; 33.43,8.25 C59.2 33.73,10.77 v1(34.21,10.77) ; 33.43,8.25 32.89,7.72 ; v1(28.12,6.77) 28.54,7.19 C62.1 ; C62.1 28.84,7.19 29.37,7.72 32.89,7.72 ; C62.1 28.72,7.15 v1(29.24,6.63) ; C62.1 28.6,7.3 28.6,10.35 28.66,10.41 ; 28.66,10.41 28.6,10.46 v1(28.6,12.47) ; 28.66,10.41 C60.2 ; v1(36.88,6.77) 36.46,7.19 C58.2 35.59,6.55 v1(34.1,6.55) 33.47,7.19 C61.1 32.89,7.72
VBLDO1: length 36.8
  Top Layer w0.201: U5.30 34.37,24.89 v1(34.57,25.09) ; v1(29.11,20.65) 29.55,20.65 U5.11 ; v1(31.39,26.59) 30.75,25.95 U5.37 ; 21.64,5.62 21.47,5.62 20.55,6.55 U2.12
  Top Layer w0.432: v1(22.12,4.98) 21.64,5.46 21.64,5.62
  Bottom Layer w0.482: C47.2 31.34,26.54 v1(31.39,26.59)
  Bottom Layer w0.508: 22.59,5.64 22.59,5.39 22.17,4.98 v1(22.12,4.98)
  Bottom Layer w0.533: v1(34.57,25.09) 32.06,25.09 31.44,25.7
  Bottom Layer w0.635: 31.25,25.79 30.43,24.97 29.84,24.97 29.11,24.23 v1(29.11,20.65) 28.83,20.93 26.62,20.93 25.24,19.56 25.24,16.8 24.66,16.22 24.66,7.14 23.17,5.64 22.67,5.64
VBLDO2: length 3.7
  Top Layer w0.201: U2.14 20.53,7.34 20.62,7.44 21.13,7.44 21.51,7.06 21.64,7.06
  Top Layer w0.432: v1(22.15,6.38) 21.55,6.97 21.64,7.06
  Bottom Layer w0.508: v1(22.15,6.38) 21.75,5.98 R12.1
VDCDC2: length 69.4
  Top Layer w0.089: U2.26 17.3,10.47 17.3,11.17 17.06,11.4 14.85,11.4 14.58,11.68 14.58,12.92 14.28,13.23 13.94,13.23 13.77,13.41 13.77,13.97
  Top Layer w0.178: U3.24 21.56,20.04 v1(21.55,20.05)
  Top Layer w0.201: v1(20.88,17.98) 20.81,17.98 U3.20 ; 15.56,27.77 15.56,28.46 v1(15.2,28.81) ; U3.45 21.51,28.26 21.61,28.37 v1(21.77,28.37) ; v1(14.16,18.09) 14.16,18.95
  Top Layer w0.508: v1(13.95,14.96) 13.95,14.16 13.77,13.97 L2.2
  Inner2 w0.457: v1(22.69,29.45) 22.15,28.91 21.62,28.91 21.08,29.44 20.45,29.44
  Inner2 w0.508: 20.45,29.44 15.83,29.44 v1(15.2,28.81)
  Inner2 w0.635: v1(23.47,19.83) 23.47,19.02
  Inner2 w0.762: 23.42,18.97 23.42,17.36 20.89,14.83 v1(20.83,14.83) 20.26,14.83 19.58,15.52 16.71,15.52 v1(15.65,16.59) 13.59,16.59 10.9,19.28 10.9,26.74 v1(11.58,27.43)
  Bottom Layer w0.201: v1(23.47,19.83) 22.75,20.55 21.92,20.55 21.55,20.18 v1(21.55,20.05)
  Bottom Layer w0.254: 20.22,17.09 C35.1 ; v1(15.65,16.59) 14.93,17.3 14.93,19.05 14.71,19.27 C34.2 14.16,19.24 v1(14.16,18.09) ; 20.22,17.09 20.88,17.75 v1(20.88,17.98)
  Bottom Layer w0.381: v1(22.69,29.45) 23.05,29.45 23.35,29.16 C37.1 22.63,28.4 22.01,28.4 21.98,28.37 v1(21.77,28.37)
  Bottom Layer w0.508: v1(11.58,27.43) 12.52,27.43 ; 13.95,14.97 14.03,14.97 v1(15.65,16.59) ; v1(15.2,28.81) 13.89,27.51 C38.2 C39.2 ; v1(20.83,14.83) 20.83,16.49 20.2,17.12 C35.1
VDCDC5: length 51.6
  Top Layer w0.089: U2.32 14.55,9.34 14.47,9.42 14.28,9.42 14.19,9.51 12.43,9.51 11.96,9.98 11.96,10.27 11.82,10.41 C20.1
  Top Layer w0.254: U7.1 38.27,6.73 LED4.2
  Top Layer w0.508: v2(10.19,10.39) 11.24,10.39 C20.1 11.26,7.94
  Top Layer w1.016: U7.1 38.27,4.13 v2(37.16,3.02)
  Inner2 w1.524: v2(10.19,10.39) 10.19,9.48 7.76,7.05 7.76,4.2 10.88,1.09 35.23,1.09 v2(37.16,3.02)
VSYS: length 45.8
  Top Layer w0.127: LED1.2 10.11,4.04
  Top Layer w0.201: v1(14.34,7.72) 14.37,7.74 U2.36 ; C15.2 18.07,12.31 U2.24 ; U2.34 14.39,8.54 v1(14.37,8.57) ; v1(18.47,11.21) 18.47,10.44 ; v1(20.69,6.94) U2.13 ; U2.7 v1(18.07,4.78) ; v1(20.69,8.54) U2.17
  Top Layer w0.508: v1(17.78,12.85) 18.16,12.47 C15.2
  Inner2 w0.254: v1(10.11,4.04) 10.34,4.27 11.22,4.27 13.65,6.7 13.65,8.26 13.95,8.57 v1(14.37,8.57)
  Inner2 w0.61: 14.63,8.57 14.45,8.57
  Inner2 w1.016: 14.77,8.7 16.28,10.22 ; 16.28,10.22 16.28,11.35 v1(17.78,12.85) ; 16.28,10.22 19.26,10.22 19.86,10.82 v1(21.64,10.82) ; 18.57,3.1 17.02,4.65 17.02,5.21 15.52,6.71 15.52,7.68 14.63,8.57
  Bottom Layer w0.355: v1(14.34,7.72) 13.1,7.72 C4.2
  Bottom Layer w0.406: v1(14.37,8.57) 13.55,8.57 C4.2
  Bottom Layer w0.508: v1(18.47,11.21) 18.47,12.23 18.24,12.47 18.16,12.47 v1(17.78,12.85) ; v1(21.64,10.82) 21.64,8.54 ; v1(20.69,8.54) 21.64,8.54 ; 21.64,8.54 21.64,7.4 21.18,6.94 v1(20.69,6.94) ; v1(18.07,4.78) 18.07,3.52 v1(18.72,2.88)
WL_RESETN: length 15.5
  Top Layer w0.089: 22.24,20.74 23.28,20.74 25.42,18.59 31.79,18.59 33.45,20.25 33.45,21.06 33.27,21.24 33.27,22.22 33.54,22.49 U5.24
WL_SDIO_CLK: length 8.3
  Top Layer w0.089: U5.16 31.55,20.87 31.24,21.18 29.46,21.18 29.31,21.03 28.09,21.03 27.89,21.23 C46.1 26.98,21.23 25.02,23.19 R7.1
WL_SDIO_CMD: length 9.9
  Top Layer w0.089: 22.24,22.84 22.24,22.83 23.34,22.83 23.43,22.75 23.65,22.75 25.74,20.65 27.94,20.65 v1(28.3,20.29) 28.54,20.05 29.73,20.05 29.95,20.28 U5.12
  Bottom Layer w0.089: R17.1 28.72,19.87 v1(28.3,20.29)
WL_SDIO_D0: length 10.4
  Top Layer w0.089: U5.13 30.35,20.25 29.9,19.79 27.97,19.79 27.48,20.27 v1(27,20.27) 25.6,20.27 23.38,22.49 22.24,22.49
  Bottom Layer w0.089: v1(27,20.27) R16.1
WL_SDIO_D1: length 10.9
  Top Layer w0.089: 22.24,22.14 23.28,22.14 25.45,19.96 26.57,19.96 27.03,19.51 30.15,19.51 v1(30.52,19.88) 30.75,20.11 U5.14
  Bottom Layer w0.089: R15.1 30.05,19.88 v1(30.52,19.88)
WL_SDIO_D2: length 12.3
  Top Layer w0.089: 22.24,21.09 23.39,21.09 25.48,19 31.14,19 v1(31.95,19.81) ; 31.95,19.81 U5.17
  Bottom Layer w0.089: v1(31.95,19.81) 32.51,19.81
WL_SDIO_D3: length 11.5
  Top Layer w0.089: U3.28 22.94,21.44 22.99,21.39 23.55,21.39 25.71,19.22 30.25,19.22 30.38,19.35 v1(30.68,19.35) 31.15,19.83 U5.15
  Bottom Layer w0.089: v1(30.68,19.35) 30.79,19.35 R13.1
WL_WAKE_AP: length 22.2
  Top Layer w0.089: v1(26.8,26.44) 27.99,26.44 29.41,25.02 31.29,25.02 31.55,25.28 U5.35 ; v1(21.49,21.23) 21.49,20.68 21.78,20.39 22.24,20.39
  Inner2 w0.178: v1(26.8,26.44) 25.76,27.48 24.76,27.48 23.82,28.42 22.56,28.42 21.92,27.79 21.92,25.58 23.01,24.49 23.01,23.06 23.55,22.53 23.55,21.59 23.19,21.23 v1(21.49,21.23)
$1N12656: length 2.9
  Top Layer w0.201: v1(16.13,28.78) 16.26,28.78 16.61,28.43 U3.59
  Bottom Layer w0.254: v1(16.13,28.78) 16.12,28.78 15.27,27.92 C43.1
$1N12908: length 2.6
  Top Layer w0.15: 17.31,27.77 17.31,28.61 v1(17.41,28.71)
  Bottom Layer w0.254: C44.1 17.04,27.83 17.04,28.15 17.41,28.52 v1(17.41,28.71)
$1N16208: length 13.2
  Top Layer w0.089: v1(8.38,20.73) 8.64,20.73 9.12,20.25 X1.3 9.39,20.25 10.54,19.1 13.71,19.1 14.19,19.6 18.83,19.6 19.06,19.37 19.06,18.95
  Bottom Layer w0.089: C26.2 9.24,20.38 8.9,20.73 v1(8.38,20.73)
$1N20830: length 1.5
  Top Layer w0.089: 22.24,23.19 23.78,23.19
$1N21788: length 14
  Top Layer w0.089: v1(11.89,21.41) 11.05,21.41 X1.1 10.91,21.4 10.18,20.67 10.18,19.79 10.64,19.33 13.66,19.33 14.21,19.88 18.93,19.88 19.41,19.41 19.41,18.95
  Bottom Layer w0.089: C21.1 11.08,21.41 v1(11.89,21.41)
$1N38721: length 3.6
  Top Layer w0.089: R8.1 18.54,16.48 16.96,18.06 16.96,18.95
$1N45957: length 1.6
  Top Layer w0.254: v1(8.73,27.87) LED2.2
  Bottom Layer w0.254: v1(8.73,27.87) R10.2
$1N46132: length 3.5
  Top Layer w0.127: 14.16,27.87 LED2.1
$1N73746: length 15.8
  Top Layer w0.127: 14.86,27.77 14.86,28.48 14.47,28.87 D3.2 7.09,28.87 6.15,27.93 SW2.2 SW2.1
$1N73815: length 3.7
  Top Layer w0.127: 13.42,27.04 11.72,27.04 10.65,25.96 LED3.1
$1N73851: length 1.6
  Top Layer w0.254: v1(8.73,25.44) LED3.2
  Bottom Layer w0.254: v1(8.73,25.44) R11.2
$2N10495: length 3
  Top Layer w0.201: v1(14.42,9.8) 14.47,9.75 U2.31
  Bottom Layer w0.201: R4.2 12.9,10.05 13.15,9.8 v1(14.42,9.8)
$2N11092: length 2.1
  Top Layer w0.201: v1(16.08,4.89) U2.2
  Bottom Layer w0.305: v1(16.08,4.89) 16.08,3.32 C6.1
$2N11570: length 2.3
  Top Layer w0.127: 11.77,5.38 11.25,4.86 11.25,4.1 LED1.1
$2N11617: length 3.1
  Top Layer w0.127: R5.2 12.73,5.44 U2.1
$2N15237: length 13.2
  Top Layer w0.127: R6.2 10.53,6.04 10.53,8.24 9.63,9.14 9.63,10.83 10.21,11.4 11.84,11.4 v1(12.24,11.81) ; U2.30 14.93,10.44 v1(14.43,10.95)
  Bottom Layer w0.127: v1(14.43,10.95) 14.43,11.4 13.87,11.96 13.46,11.96 12.95,12.48 12.9,12.48 12.9,12.47 v1(12.24,11.81)
$2N32332: length 5.8
  Top Layer w0.254: v1(12.47,13.31) 11.95,12.79 U1.2
  Bottom Layer w0.254: v1(12.47,13.31) 12.65,13.49 C2.1 13.26,14.48 13.26,15.9 11.89,17.27 11.89,17.3
$2N38791: length 16.8
  Top Layer w0.127: D2.1 12.09,16.69 v1(11.12,17.65) ; U2.38 14.97,6.94 14.36,6.94 v1(14.1,6.68)
  Bottom Layer w0.127: v1(14.1,6.68) 15.51,8.09 15.51,10.12 14.91,10.72 14.91,11.33 13.54,12.7 13.54,16.51 12.09,17.96 11.43,17.96 v1(11.12,17.65)
$3N23741: length 26.6
  Top Layer w0.201: C53.2 27.69,24.89 28.85,24.89 ; U5.22 34.4,21.69 34.45,21.64 v1(34.93,21.64) ; v1(34.57,23.86) 34.34,24.09 U5.28 ; U5.36 31.15,25.93 31.4,26.17 31.69,26.17 31.83,26.31 v1(31.9,26.31)
  Top Layer w0.508: C53.2 27.23,25.48 v1(27.69,25.93) ; L5.2 37.04,20.88 C55.2 v3(37.76,19.76)
  Inner2 w1.016: 32.03,26.06 31.5,25.53 28.09,25.53 v1(27.69,25.93)
  Bottom Layer w0.457: v1(31.9,26.31) C52.2
  Bottom Layer w0.508: 35.18,21.27 36.68,19.76 v3(37.76,19.76) ; 35.18,21.27 35.18,21.89 ; 35.18,21.27 34.93,21.52 v1(34.93,21.64) 35.18,21.89 ; 34.59,23.88 35.18,24.47 ; 35.18,24.47 35.18,25.34 34.82,25.7 33.23,25.7 32.69,26.24 C52.2 ; 35.18,24.47 35.18,23.25 ; 35.18,23.25 v1(34.57,23.86) ; 35.18,23.25 35.18,21.89
$3N23892: length 3.8
  Top Layer w0.201: U5.29 34.76,24.49
  Top Layer w0.635: 34.76,24.49 34.84,24.49 35.2,24.13 35.2,23.42 35.94,22.68 36.5,22.68
$3N25604: length 1.9
  Top Layer w0.201: 27.1,24.18 27.41,24.49 U5.2
$3N25806: length 1.5
  Top Layer w0.201: U5.26 34.26,23.29 v1(34.57,22.98)
  Bottom Layer w0.508: C51.1 34.42,22.83 v1(34.57,22.98)
$3N25918: length 2.4
  Top Layer w0.201: v1(30.78,26.57) 30.78,26.49 30.35,26.06 U5.38
  Bottom Layer w0.457: C48.2 30.05,25.9 30.45,25.9 30.78,26.24 v1(30.78,26.57)
$3N27722: length 2.9
  Top Layer w0.299: 32.36,28.52 L7.1
$3N28512: length 1.4
  Top Layer w0.201: U5.21 34.32,21.29 v1(34.52,21.08)
  Bottom Layer w0.508: C50.1 34.14,21.46 v1(34.52,21.08)
$3N38594: length 4
  Top Layer w0.299: 29.56,27.62 arc(29.82,28.26) 30.45,28.52 30.71,28.52 ; 29.55,25.98 29.55,27.62 ; C54.2 31.46,28.52
$4N1560: length 9.2
  Top Layer w0.254: LED5.1 39.3,15.62 38.33,15.62 37.47,14.76 36.68,14.76 34.49,12.57 34.49,11.56 34.78,11.27 U10.10
$4N1563: length 1.7
  Top Layer w0.254: LED5.2 39.52,16.91 39.52,17.21 R22.2
$4N2188: length 4
  Top Layer w0.17: R28.1 25.36,10.61 25.36,9.08 25.67,8.77 U10.32
$4N2309: length 2.4
  Top Layer w0.17: R27.1 25.36,8.27 U10.33
$4N9709: length 5.9
  Top Layer w0.254: U10.11 36.52,11.77 37.21,12.46 v1(37.21,13.21)
  Bottom Layer w0.254: R24.2 D4.1 38.58,14.02 37.97,13.41 37.41,13.41 v1(37.21,13.21)
$4N9748: length 6.8
  Top Layer w0.254: v1(36.68,14.09) 36.68,12.57 36.38,12.27 U10.12
  Bottom Layer w0.254: v1(36.68,14.09) 37.39,14.8 37.8,14.8 38.58,15.59 D5.1 R25.2
$4N9789: length 8.4
  Top Layer w0.254: v1(38.41,16.81) 35.99,16.81 33.6,14.43 U10.14
  Bottom Layer w0.254: v1(38.41,16.81) 38.58,16.99 D6.1 R26.2
$4N13286: length 13.8
  Top Layer w0.254: U10.31 v1(31.45,9.27)
  Inner2 w0.254: v1(38.07,10.49) 36.85,9.27 v1(31.45,9.27)
  Bottom Layer w0.254: R29.1 D8.2 38.58,11 v1(38.07,10.49)
$4N13859: length 1.7
  Top Layer w0.254: LED7.2 39.52,11.84 39.52,12.13 R32.1
$4N14179: length 16.1
  Top Layer w0.254: U10.30 v1(31,9.77) ; LED6.1 39.97,13.73 v1(40.41,13.28)
  Inner2 w0.254: v1(38.07,12.01) 38.07,11.11 37.73,10.77 36.78,10.77 35.78,9.77 v1(31,9.77)
  Bottom Layer w0.254: v1(38.07,12.01) 38.58,12.52 D7.2 R30.1 39.98,12.85 v1(40.41,13.28)
$4N14227: length 1.7
  Top Layer w0.254: LED6.2 39.52,14.38 39.52,14.67 R31.1
$4N30757: length 1.7
  Top Layer w0.254: R23.1 39.42,6.5 39.42,6.88 39.87,7.33 LED4.1
$4N31270: length 1.7
  Top Layer w0.127: v1(8.44,16.25) USB1.A5
  Bottom Layer w0.127: v1(8.44,16.25) 9.17,16.25
$4N31271: length 1.7
  Top Layer w0.127: v1(8.44,13.25) USB1.B5
  Bottom Layer w0.127: v1(8.44,13.25) 9.17,13.25 R20.2

## Copper pours and planes (outline as drawn; the poured copper is in the pictures)
GND on Top Layer: 27.29,29.84 27.29,26.21 34.18,26.21 34.18,29.84
GND on Inner1: 0,30 50,30 50,0 0,0
(no net) on Bottom Layer: 2.43,27.74 3.51,27.74 3.51,26.66 2.43,26.66
(no net) on Bottom Layer: 0.91,3.54 1.99,3.54 1.99,2.46 0.91,2.46
(no net) on Bottom Layer: 0.91,2.01 1.99,2.01 1.99,0.93 0.91,0.93
(no net) on Bottom Layer: 11.58,5.06 12.65,5.06 12.65,3.98 11.58,3.98
(no net) on Bottom Layer: 42.79,2.01 43.87,2.01 43.87,0.93 42.79,0.93
(no net) on Bottom Layer: 5.48,29.27 6.56,29.27 6.56,28.19 5.48,28.19
(no net) on Bottom Layer: 41.27,6.58 42.35,6.58 42.35,5.51 41.27,5.51
(no net) on Bottom Layer: 38.22,2.01 39.3,2.01 39.3,0.93 38.22,0.93
(no net) on Bottom Layer: 3.96,23.17 5.03,23.17 5.03,22.09 3.96,22.09
(no net) on Bottom Layer: 38.22,6.58 39.3,6.58 39.3,5.51 38.22,5.51
(no net) on Bottom Layer: 0.91,6.58 1.99,6.58 1.99,5.51 0.91,5.51
(no net) on Bottom Layer: 7,24.69 8.08,24.69 8.08,23.62 7,23.62
(no net) on Bottom Layer: 7,3.54 8.08,3.54 8.08,2.46 7,2.46
(no net) on Bottom Layer: 38.22,5.06 39.3,5.06 39.3,3.98 38.22,3.98
(no net) on Bottom Layer: 13.1,5.06 14.18,5.06 14.18,3.98 13.1,3.98
(no net) on Bottom Layer: 44.32,2.01 45.4,2.01 45.4,0.93 44.32,0.93
(no net) on Bottom Layer: 5.48,27.74 6.56,27.74 6.56,26.66 5.48,26.66
(no net) on Bottom Layer: 2.43,6.58 3.51,6.58 3.51,5.51 2.43,5.51
(no net) on Bottom Layer: 39.75,6.58 40.82,6.58 40.82,5.51 39.75,5.51
(no net) on Bottom Layer: 11.58,3.54 12.65,3.54 12.65,2.46 11.58,2.46
(no net) on Bottom Layer: 7,27.74 8.08,27.74 8.08,26.66 7,26.66
(no net) on Bottom Layer: 41.27,2.01 42.35,2.01 42.35,0.93 41.27,0.93
(no net) on Bottom Layer: 42.79,3.54 43.87,3.54 43.87,2.46 42.79,2.46
(no net) on Bottom Layer: 44.32,5.06 45.4,5.06 45.4,3.98 44.32,3.98
(no net) on Bottom Layer: 39.75,8.11 40.82,8.11 40.82,7.03 39.75,7.03
(no net) on Bottom Layer: 3.96,5.06 5.03,5.06 5.03,3.98 3.96,3.98
(no net) on Bottom Layer: 0.91,26.22 1.99,26.22 1.99,25.14 0.91,25.14
(no net) on Bottom Layer: 39.75,2.01 40.82,2.01 40.82,0.93 39.75,0.93
(no net) on Bottom Layer: 5.48,5.06 6.56,5.06 6.56,3.98 5.48,3.98
(no net) on Bottom Layer: 8.53,3.54 9.61,3.54 9.61,2.46 8.53,2.46
(no net) on Bottom Layer: 10.05,2.01 11.13,2.01 11.13,0.93 10.05,0.93
(no net) on Bottom Layer: 13.1,3.54 14.18,3.54 14.18,2.46 13.1,2.46
(no net) on Bottom Layer: 8.53,6.58 9.61,6.58 9.61,5.51 8.53,5.51
(no net) on Bottom Layer: 3.96,2.01 5.03,2.01 5.03,0.93 3.96,0.93
(no net) on Bottom Layer: 3.96,24.69 5.03,24.69 5.03,23.62 3.96,23.62
(no net) on Bottom Layer: 7,2.01 8.08,2.01 8.08,0.93 7,0.93
(no net) on Bottom Layer: 2.43,24.69 3.51,24.69 3.51,23.62 2.43,23.62
(no net) on Bottom Layer: 38.22,3.54 39.3,3.54 39.3,2.46 38.22,2.46
(no net) on Bottom Layer: 41.27,5.06 42.35,5.06 42.35,3.98 41.27,3.98
(no net) on Bottom Layer: 3.96,27.74 5.03,27.74 5.03,26.66 3.96,26.66
(no net) on Bottom Layer: 5.48,3.54 6.56,3.54 6.56,2.46 5.48,2.46
(no net) on Bottom Layer: 38.22,8.11 39.3,8.11 39.3,7.03 38.22,7.03
(no net) on Bottom Layer: 0.91,24.69 1.99,24.69 1.99,23.62 0.91,23.62
(no net) on Bottom Layer: 0.91,29.27 1.99,29.27 1.99,28.19 0.91,28.19
(no net) on Bottom Layer: 39.75,9.63 40.82,9.63 40.82,8.55 39.75,8.55
(no net) on Bottom Layer: 42.79,6.58 43.87,6.58 43.87,5.51 42.79,5.51
(no net) on Bottom Layer: 13.1,2.01 14.18,2.01 14.18,0.93 13.1,0.93
(no net) on Bottom Layer: 10.05,3.54 11.13,3.54 11.13,2.46 10.05,2.46
(no net) on Bottom Layer: 41.27,9.63 42.35,9.63 42.35,8.55 41.27,8.55
(no net) on Bottom Layer: 3.96,29.27 5.03,29.27 5.03,28.19 3.96,28.19
(no net) on Bottom Layer: 3.96,26.22 5.03,26.22 5.03,25.14 3.96,25.14
(no net) on Bottom Layer: 7,26.22 8.08,26.22 8.08,25.14 7,25.14
(no net) on Bottom Layer: 38.22,9.63 39.3,9.63 39.3,8.55 38.22,8.55
(no net) on Bottom Layer: 44.32,8.11 45.4,8.11 45.4,7.03 44.32,7.03
(no net) on Bottom Layer: 2.43,29.27 3.51,29.27 3.51,28.19 2.43,28.19
(no net) on Bottom Layer: 5.48,23.17 6.56,23.17 6.56,22.09 5.48,22.09
(no net) on Bottom Layer: 5.48,26.22 6.56,26.22 6.56,25.14 5.48,25.14
(no net) on Bottom Layer: 11.58,2.01 12.65,2.01 12.65,0.93 11.58,0.93
(no net) on Bottom Layer: 44.32,9.63 45.4,9.63 45.4,8.55 44.32,8.55
